# EAGLE schematic node (EAGLE 6.4)
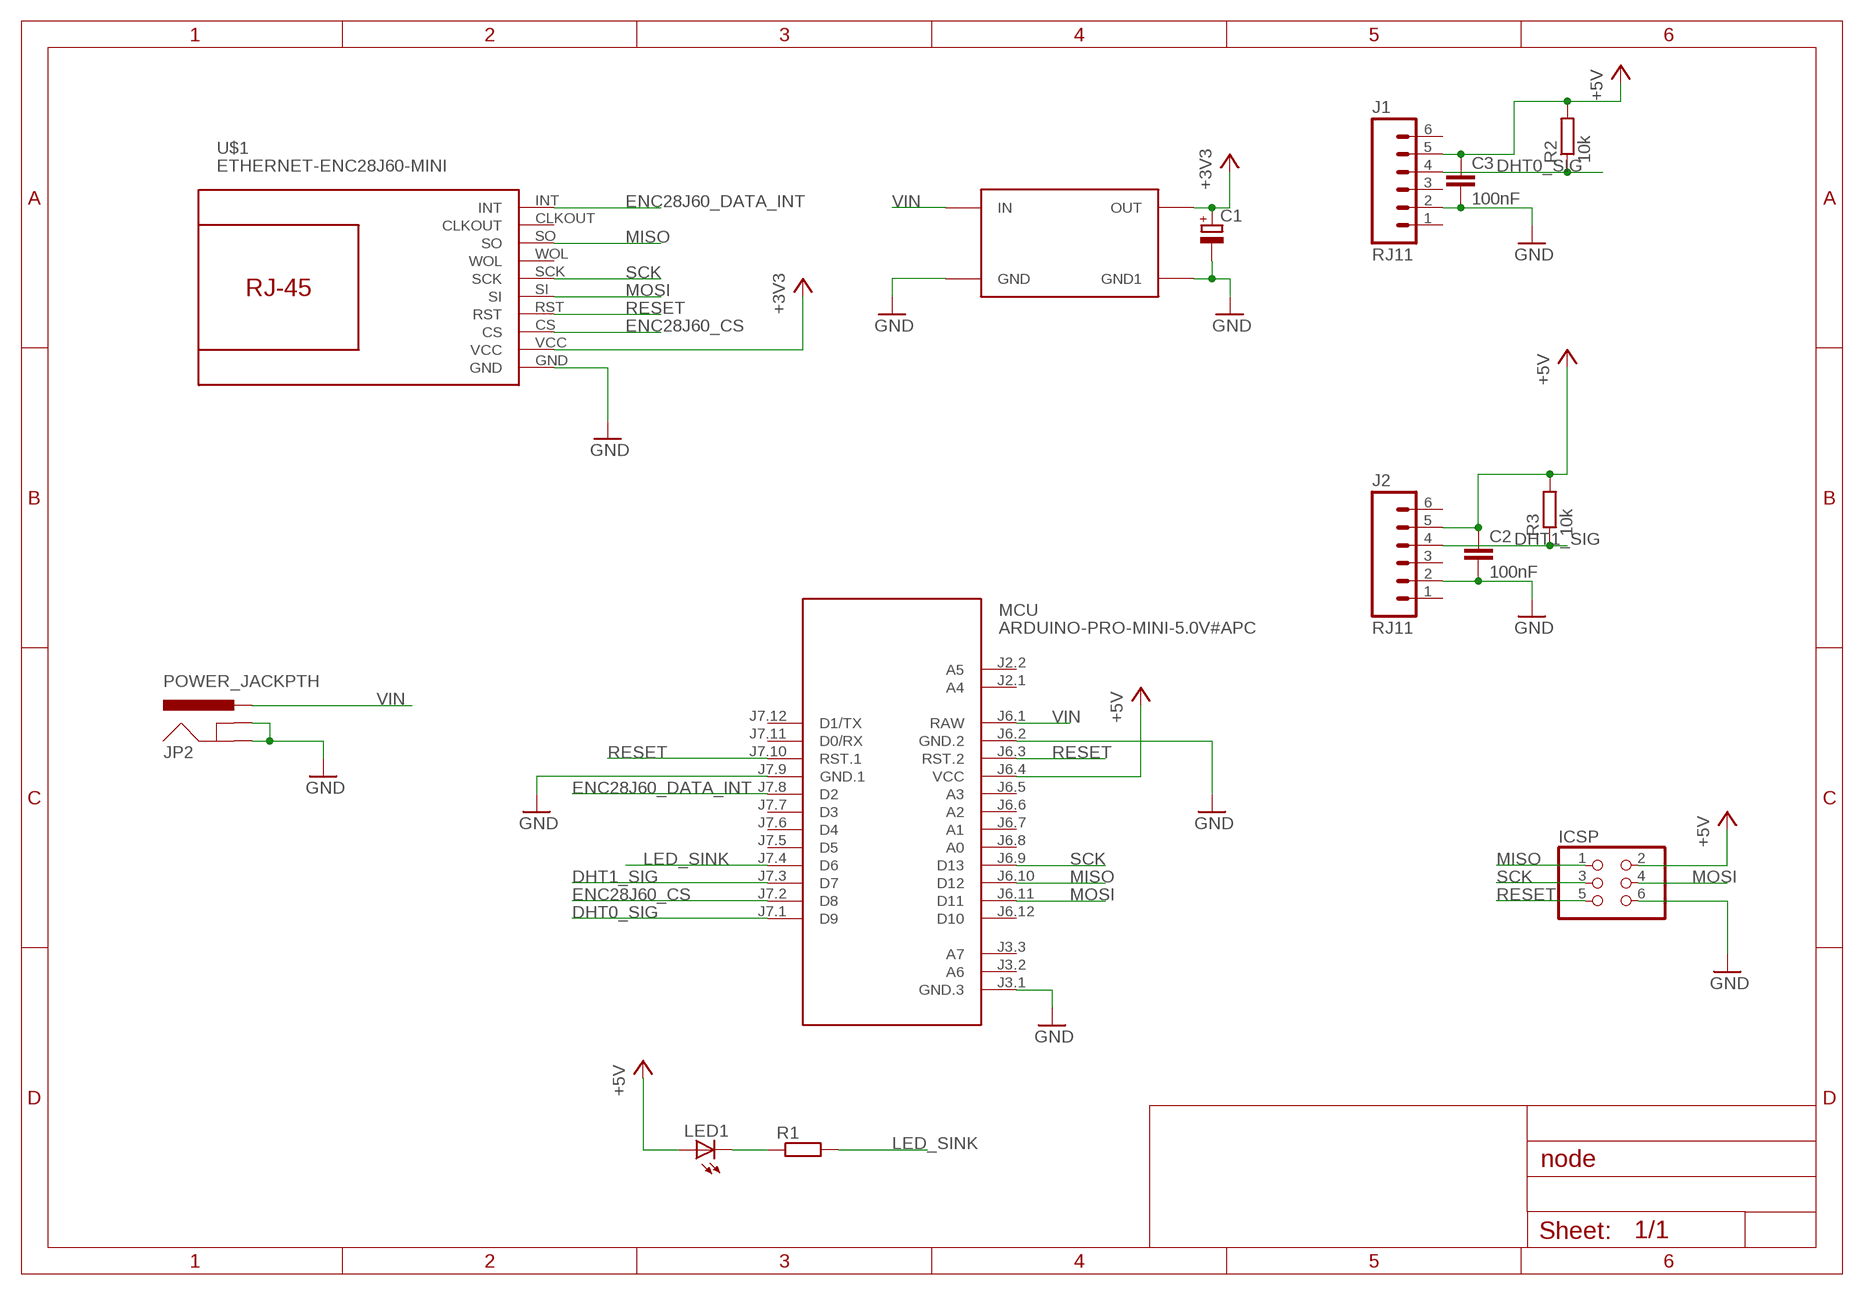
[diagram p0: schematic, sheet 1]

## Parts
C1  CPOL-EUE2.5-6  [E2,5-6]
C2  100nF  C-EUC0805  [C0805]
C3  100nF  C-EUC0805  [C0805]
ICSP  PINHD-2X3  [2X03]
J1  RJ11  RJ11-6PTH  [RJ11-6]
J2  RJ11  RJ11-6PTH  [RJ11-6]
JP2  POWER_JACKPTH  [POWER_JACK_PTH]
LED1  LED3MM  [LED3MM]
MCU  ARDUINO-PRO-MINI-5.0V#APC  [ARDUINO-PRO-MINI#APC]
R1  R-EU_0204/7  [0204/7]
R2  10k  R-EU_R0805  [R0805]
R3  10k  R-EU_R0805  [R0805]
U$1  ETHERNET-ENC28J60-MINI  [ETHERNET-ENC28J60-MINI]
U$2  DC-DC-SMALL  [DC-DC]

## Nets
+3V3: C1.+ U$1.VCC U$2.P$2(OUT)
+5V: C2.1 C3.1 ICSP.2 J1.5 J2.5 LED1.A MCU.J6.4(VCC) R2.2 R3.2
DHT0_SIG: J1.4 MCU.J7.1(D9) R2.1
DHT1_SIG: J2.4 MCU.J7.3(D7) R3.1
ENC28J60_CS: MCU.J7.2(D8) U$1.CS
ENC28J60_DATA_INT: MCU.J7.8(D2) U$1.INT
GND: C1.- C2.2 C3.2 ICSP.6 J1.2 J2.2 JP2.GND JP2.GNDBREAK MCU.J3.1(GND.3) MCU.J6.2(GND.2) MCU.J7.9(GND.1) U$1.GND U$2.P$3(GND) U$2.P$4(GND1)
LED_SINK: MCU.J7.4(D6) R1.2
MISO: ICSP.1 MCU.J6.10(D12) U$1.SO
MOSI: ICSP.4 MCU.J6.11(D11) U$1.SI
N$1: LED1.K(C) R1.1
RESET: ICSP.5 MCU.J6.3(RST.2) MCU.J7.10(RST.1) U$1.RST
SCK: ICSP.3 MCU.J6.9(D13) U$1.SCK
VIN: JP2.PWR MCU.J6.1(RAW) U$2.P$1(IN)
Unconnected: J1.1 J1.3 J1.6 J2.1 J2.3 J2.6 MCU.J2.1(A4) MCU.J2.2(A5) MCU.J3.2(A6) MCU.J3.3(A7) MCU.J6.5(A3) MCU.J6.6(A2) MCU.J6.7(A1) MCU.J6.8(A0) MCU.J6.12(D10) MCU.J7.5(D5) MCU.J7.6(D4) MCU.J7.7(D3) MCU.J7.11(D0/RX) MCU.J7.12(D1/TX) U$1.CLKOUT U$1.WOL

## Library data of the parts
C1 = rcl:CPOL-EU: POLARIZED CAPACITOR, European symbol
C2 C3 = rcl:C-EU: CAPACITOR, European symbol
ICSP = pinhead:PINHD-2X3: PIN HEADER
J1 J2 = SparkFun-Connectors:RJ11-6: RJ11 Jack Simple 6 pin RJ11 jack. Commonly found on CAT3 devices and Microchip programmers. SKU: PRT-00132; PROD_ID: CONN-08590
JP2 = SparkFun-Connectors:POWER_JACK: Power Jack This is the standard 5.5mm barrel jack for power. The PTH is the most common, proven, reliable, footprint. The Slot footprint only works if the mill layer is transmitted to the PCB fab house so be warned. Mating wall wart : TOL-00298 (and others); PROD_ID: CONN-08197
LED1 = adafruit:LED: LED OSRAM: - CHIPLED LG R971, LG N971, LY N971, LG Q971, LY Q971, LO R971, LY R971 LH N974, LH R974 LS Q976, LO Q976, LY Q976 LO Q996 - Hyper CHIPLED LW Q18S LB Q993, LB Q99A, LB R99A - SideLED LS A670, LO A670, LY A670, LG A670, LP A670 LB A673, LV A673, LT A673, LW A673 LH A674 LY A675 LS A676, LA A676, LO A676, LY A676, LW A676 LS A679, LY A679, LG A679 - Hyper Micro SIDELED® LS Y876, LA Y876, LO Y876, LY Y876 LT Y87S - SmartLED LW L88C, LW L88S LB L89C, LB L89S, LG L890 LS L89K, LO L89K, LY L89K LS L896, LA L896, LO L896, LY L896 - TOPLED LS T670, LO T670, LY T670, LG T670, LP T670 LSG T670, LSP T670, LSY T670, LOP T670, LYG T670 LG T671, LOG T671, LSG T671 LB T673, LV T673, LT T673, LW T673 LH T674 LS T676, LA T676, LO T676, LY T676, LB T676, LH T676, LSB T676, LW T676 LB T67C, LV T67C, LT T67C, LS T67K, LO T67K, LY T67K, LW E67C LS E67B, LA E67B, LO E67B, LY E67B, LB E67C, LV E67C, LT E67C LW T67C LS T679, LY T679, LG T679 LS T770, LO T770, LY T770, LG T770, LP T770 LB T773, LV T773, LT T773, LW T773 LH T774 LS E675, LA E675, LY E675, LS T675 LS T776, LA T776, LO T776, LY T776, LB T776 LHGB T686 LT T68C, LB T68C - Hyper Mini TOPLED® LB M676 - Mini TOPLED Santana® LG M470 LS M47K, LO M47K, LY M47K Source: http://www.osram.convergy.de/
MCU = diy-modules:ARDUINO-PRO-MINI-*#APC: Arduino Pro Mini with angle programming connector
R1-R3 = rcl:R-EU_: RESISTOR, European symbol
U$1 = diy-modules:ETHERNET-ENC28J60-MINI
U$2 = OK1CDJ-E6:DC-DC-SMALL